# EAGLE schematic untitled (EAGLE 9.6.2)
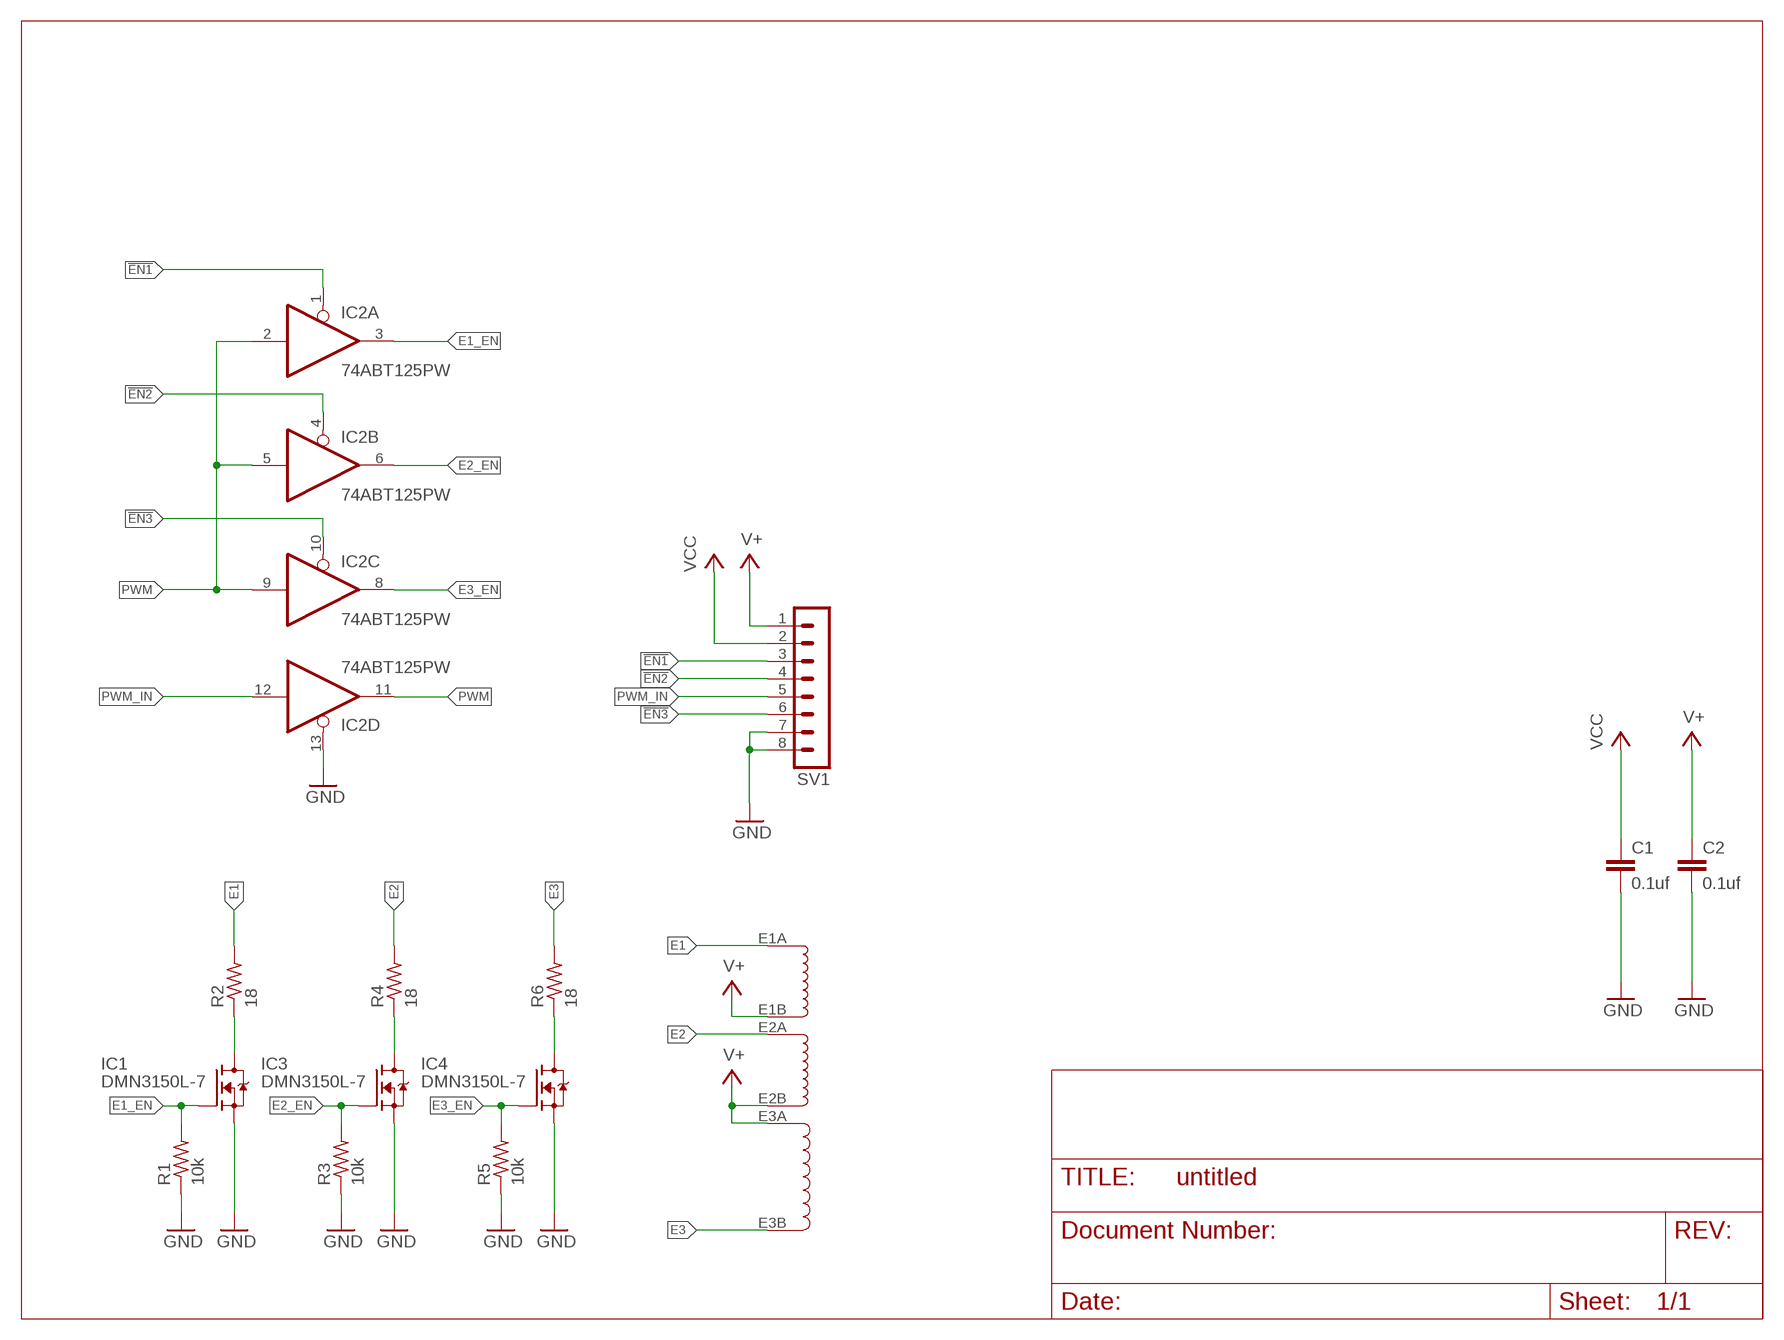
[diagram p0: schematic, sheet 1]

## Parts
C1  0.1uf  C-EUC0603  [C0603]
C2  0.1uf  C-EUC0603  [C0603]
IC1  DMN3150L-7  DS31126  [SOT23]
IC2  74ABT125PW  [TSSOP14]
IC3  DMN3150L-7  DS31126  [SOT23]
IC4  DMN3150L-7  DS31126  [SOT23]
NICR1  HOT_WIRE  [LAYOUT_A]
R1  10k  R-US_R0603  [R0603]
R2  18  R-US_R2512W  [R2512W]
R3  10k  R-US_R0603  [R0603]
R4  18  R-US_R2512W  [R2512W]
R5  10k  R-US_R0603  [R0603]
R6  18  R-US_R2512W  [R2512W]
SV1  MA08-1  [MA08-1]

## Nets
!EN1: IC2.1(A:OE) SV1.3
!EN2: IC2.4(B:OE) SV1.4
!EN3: IC2.10(C:OE) SV1.6
E1: NICR1.E1A R2.2
E1_EN: IC1.G IC2.3(A:O) R1.2
E2: NICR1.E2A R4.2
E2_EN: IC2.6(B:O) IC3.G R3.2
E3: NICR1.E3B R6.2
E3_EN: IC2.8(C:O) IC4.G R5.2
GND: C1.2 C2.2 IC1.S IC2.13(D:OE) IC3.S IC4.S R1.1 R3.1 R5.1 SV1.7 SV1.8
N$1: IC1.D R2.1
N$2: IC3.D R4.1
N$3: IC4.D R6.1
PWM: IC2.2(A:I) IC2.5(B:I) IC2.9(C:I) IC2.11(D:O)
PWM_IN: IC2.12(D:I) SV1.5
V+: C2.1 NICR1.E1B NICR1.E2B NICR1.E3A SV1.1
VCC: C1.1 SV1.2

## Power pins joined to a net without a drawn wire
GND: IC2.7(P:GND)
VCC: IC2.14(P:VCC)

## Library data of the parts
C1 C2 = rcl:C-EU: CAPACITOR, European symbol; SPICEPREFIX: C
IC1 IC3 IC4 = ds31126:DS31126
IC2 = 74xx-eu:74*125: Quad bus BUFFER, 3-state
NICR1 = logo_wire:HOT_WIRE
R1-R6 = rcl:R-US_: RESISTOR, American symbol; SPICEPREFIX: R
SV1 = con-lstb_mod:MA08-1: PIN HEADER; OC_FARNELL: unknown; OC_NEWARK: unknown